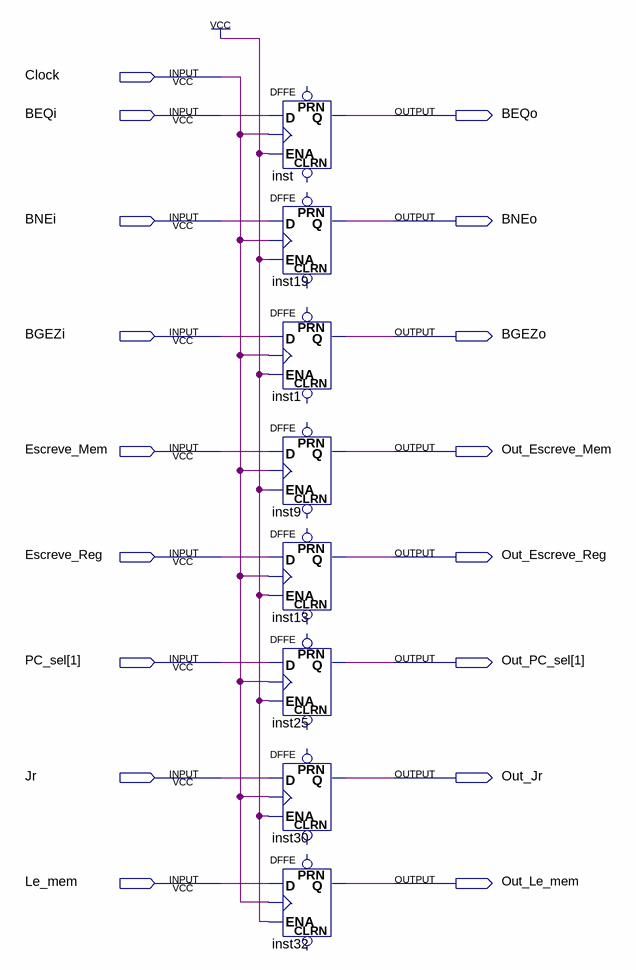
[diagram p0: schematic sheet]
// Quartus schematic EX_MEM_cont.bdf as structural Verilog: 8 symbols, 17 pins
module EX_MEM_cont (
  input  Clock,
  input  BEQi,
  input  BNEi,
  input  BGEZi,
  input  Escreve_Mem,
  input  Escreve_Reg,
  input  [1:1] PC_sel,
  input  Jr,
  input  Le_mem,
  output BEQo,
  output BNEo,
  output BGEZo,
  output Out_Escreve_Mem,
  output Out_Escreve_Reg,
  output [1:1] Out_PC_sel,
  output Out_Jr,
  output Out_Le_mem
);

  DFFE inst (.D(BEQi), .CLK(Clock), .ENA(1'b1), .Q(BEQo));  // open: PRN, CLRN
  DFFE inst19 (.D(BNEi), .CLK(Clock), .ENA(1'b1), .Q(BNEo));  // open: PRN, CLRN
  DFFE inst1 (.D(BGEZi), .CLK(Clock), .ENA(1'b1), .Q(BGEZo));  // open: PRN, CLRN
  DFFE inst9 (.D(Escreve_Mem), .CLK(Clock), .ENA(1'b1), .Q(Out_Escreve_Mem));  // open: PRN, CLRN
  DFFE inst13 (.D(Escreve_Reg), .CLK(Clock), .ENA(1'b1), .Q(Out_Escreve_Reg));  // open: PRN, CLRN
  DFFE inst25 (.D(PC_sel[1]), .CLK(Clock), .ENA(1'b1), .Q(Out_PC_sel[1]));  // open: PRN, CLRN
  DFFE inst30 (.D(Jr), .CLK(Clock), .ENA(1'b1), .Q(Out_Jr));  // open: PRN, CLRN
  DFFE inst32 (.D(Le_mem), .CLK(Clock), .ENA(1'b1), .Q(Out_Le_mem));  // open: PRN, CLRN
endmodule
